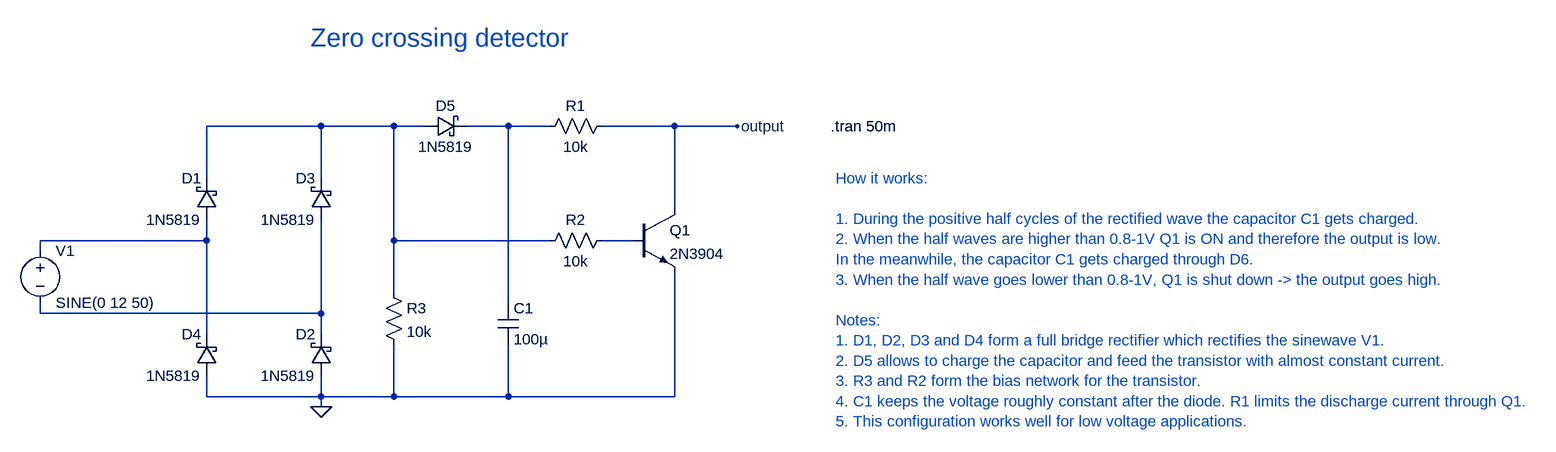
[diagram p0: schematic zero-crossing-detector-2.asc]
zero-crossing-detector-2.asc, the LTspice schematic file:
Version 4.1
SHEET 1 2152 680
WIRE 224 -112 48 -112
WIRE 336 -112 224 -112
WIRE 384 -112 336 -112
WIRE 512 -112 448 -112
WIRE 576 -112 512 -112
WIRE 768 -112 656 -112
WIRE 864 -112 768 -112
WIRE 48 -32 48 -112
WIRE 224 -32 224 -112
WIRE 768 16 768 -112
WIRE 48 64 48 32
WIRE 48 64 -208 64
WIRE 336 64 336 -112
WIRE 576 64 336 64
WIRE 704 64 656 64
WIRE -208 80 -208 64
WIRE 336 144 336 64
WIRE 512 160 512 -112
WIRE -208 176 -208 160
WIRE 224 176 224 32
WIRE 224 176 -208 176
WIRE 48 208 48 64
WIRE 224 208 224 176
WIRE 48 304 48 272
WIRE 224 304 224 272
WIRE 224 304 48 304
WIRE 336 304 336 224
WIRE 336 304 224 304
WIRE 512 304 512 224
WIRE 512 304 336 304
WIRE 768 304 768 112
WIRE 768 304 512 304
WIRE 224 320 224 304
FLAG 224 320 0
FLAG 864 -112 output
SYMBOL voltage -208 64 R0
WINDOW 123 0 0 Left 0
WINDOW 39 0 0 Left 0
SYMATTR InstName V1
SYMATTR Value SINE(0 12 50)
SYMBOL schottky 64 32 R180
WINDOW 0 24 64 Left 2
WINDOW 3 24 0 Left 2
SYMATTR InstName D1
SYMATTR Value 1N5819
SYMATTR Description Diode
SYMATTR Type diode
SYMBOL schottky 240 272 R180
WINDOW 0 24 64 Left 2
WINDOW 3 24 0 Left 2
SYMATTR InstName D2
SYMATTR Value 1N5819
SYMATTR Description Diode
SYMATTR Type diode
SYMBOL schottky 240 32 R180
WINDOW 0 24 64 Left 2
WINDOW 3 24 0 Left 2
SYMATTR InstName D3
SYMATTR Value 1N5819
SYMATTR Description Diode
SYMATTR Type diode
SYMBOL schottky 64 272 R180
WINDOW 0 24 64 Left 2
WINDOW 3 24 0 Left 2
SYMATTR InstName D4
SYMATTR Value 1N5819
SYMATTR Description Diode
SYMATTR Type diode
SYMBOL res 672 -128 R90
WINDOW 0 0 56 VBottom 2
WINDOW 3 32 56 VTop 2
SYMATTR InstName R1
SYMATTR Value 10k
SYMBOL schottky 384 -96 R270
WINDOW 0 32 32 VTop 2
WINDOW 3 0 32 VBottom 2
SYMATTR InstName D5
SYMATTR Value 1N5819
SYMATTR Description Diode
SYMATTR Type diode
SYMBOL res 672 48 R90
WINDOW 0 0 56 VBottom 2
WINDOW 3 32 56 VTop 2
SYMATTR InstName R2
SYMATTR Value 10k
SYMBOL npn 704 16 R0
SYMATTR InstName Q1
SYMATTR Value 2N3904
SYMBOL cap 496 160 R0
SYMATTR InstName C1
SYMATTR Value 100µ
SYMBOL res 320 128 R0
SYMATTR InstName R3
SYMATTR Value 10k
TEXT 1008 -112 Left 2 !.tran 50m
TEXT 1016 -32 Left 2 ;How it works:\n \n1. During the positive half cycles of the rectified wave the capacitor C1 gets charged.\n2. When the half waves are higher than 0.8-1V Q1 is ON and therefore the output is low.\nIn the meanwhile, the capacitor C1 gets charged through D6.\n3. When the half wave goes lower than 0.8-1V, Q1 is shut down -> the output goes high.\n \nNotes:\n1. D1, D2, D3 and D4 form a full bridge rectifier which rectifies the sinewave V1.\n2. D5 allows to charge the capacitor and feed the transistor with almost constant current.\n3. R3 and R2 form the bias network for the transistor.\n4. C1 keeps the voltage roughly constant after the diode. R1 limits the discharge current through Q1.\n5. This configuration works well for low voltage applications.
TEXT 208 -248 Left 4 ;Zero crossing detector

The netlist it stands for:
* zero-crossing-detector-2.asc
V1 N003 N005 SINE(0 12 50)
D1 N003 N001 1N5819
D2 0 N005 1N5819
D3 N005 N001 1N5819
D4 0 N003 1N5819
R1 output N002 10k
D5 N001 N002 1N5819
R2 N004 N001 10k
Q1 output N004 0 0 2N3904
C1 N002 0 100µ
R3 N001 0 10k
.model D D
.lib standard.dio
.model NPN NPN
.model PNP PNP
.lib standard.bjt
.tran 50m
* How it works:
* 1. During the positive half cycles of the rectified wave the capacitor C1 gets charged.
* 2. When the half waves are higher than 0.8-1V Q1 is ON and therefore the output is low.
* In the meanwhile, the capacitor C1 gets charged through D6.
* 3. When the half wave goes lower than 0.8-1V, Q1 is shut down -> the output goes high.
* Notes:
* 1. D1, D2, D3 and D4 form a full bridge rectifier which rectifies the sinewave V1.
* 2. D5 allows to charge the capacitor and feed the transistor with almost constant current.
* 3. R3 and R2 form the bias network for the transistor.
* 4. C1 keeps the voltage roughly constant after the diode. R1 limits the discharge current through Q1.
* 5. This configuration works well for low voltage applications.
* Zero crossing detector
.backanno
.end